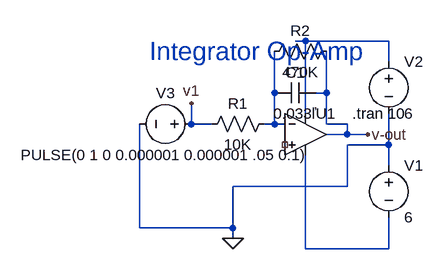
[diagram p0: schematic 5.Integrator Amplifier.asc]
5.Integrator Amplifier.asc, the LTspice schematic file:
Version 4.1
SHEET 1 880 680
WIRE 224 0 208 0
WIRE 352 0 224 0
WIRE 352 32 352 0
WIRE 176 80 176 16
WIRE 256 80 256 16
WIRE 256 80 240 80
WIRE 224 112 224 0
WIRE 48 128 48 96
WIRE 80 128 48 128
WIRE 176 128 176 80
WIRE 176 128 160 128
WIRE 192 128 176 128
WIRE 256 128 256 80
WIRE 288 128 256 128
WIRE 288 144 288 128
WIRE 288 144 256 144
WIRE 320 144 288 144
WIRE 352 160 352 112
WIRE 352 160 288 160
WIRE 352 192 352 160
WIRE 288 224 288 160
WIRE 288 224 112 224
WIRE -32 288 -32 128
WIRE 112 288 112 224
WIRE 112 288 -32 288
WIRE 112 304 112 288
WIRE 224 320 224 176
WIRE 352 320 352 272
WIRE 352 320 224 320
FLAG 112 304 0
FLAG 320 144 v-out
FLAG 48 96 v1
SYMBOL OpAmps\\UniversalOpAmp2 224 144 R0
SYMATTR InstName U1
SYMBOL voltage 352 176 R0
WINDOW 123 0 0 Left 0
WINDOW 39 0 0 Left 0
SYMATTR InstName V1
SYMATTR Value 6
SYMBOL voltage 352 16 R0
WINDOW 123 0 0 Left 0
WINDOW 39 0 0 Left 0
SYMATTR InstName V2
SYMATTR Value 6
SYMBOL voltage 64 128 R90
WINDOW 0 -32 56 VBottom 2
WINDOW 3 32 56 VTop 2
WINDOW 123 0 0 Left 0
WINDOW 39 0 0 Left 0
SYMATTR InstName V3
SYMATTR Value PULSE(0 1 0 0.000001 0.000001 .05 0.1)
SYMBOL res 176 112 R90
WINDOW 0 0 56 VBottom 2
WINDOW 3 32 56 VTop 2
SYMATTR InstName R1
SYMATTR Value 10K
SYMATTR SpiceLine tol=1 pwr=0.1
SYMBOL cap 240 64 R90
WINDOW 0 0 32 VBottom 2
WINDOW 3 32 32 VTop 2
SYMATTR InstName C1
SYMATTR Value 0.033ľ
SYMATTR SpiceLine V=25 Irms=0 Rser=0 Lser=0 mfg="Murata" pn="GCM155R71E333KA55" type="X7R"
SYMBOL res 272 0 R90
WINDOW 0 0 56 VBottom 2
WINDOW 3 32 56 VTop 2
SYMATTR InstName R2
SYMATTR Value 470K
SYMATTR SpiceLine tol=1 pwr=0.1
TEXT -16 16 Left 4 ;Integrator Op-Amp
TEXT 296 112 Left 2 !.tran 10

The netlist it stands for:
* 5.Integrator Amplifier.asc
X§U1 NC_01 N002 N001 N003 v-out level2 Avol=1Meg GBW=10Meg Slew=10Meg Ilimit=25m Rail=0 Vos=0 En=0 Enk=0 In=0 Ink=0 Rin=500Meg  ; pins In+ In- V+ V- OUT
V1 0 N003 6
V2 N001 0 6
V3 v1 0 PULSE(0 1 0 0.000001 0.000001 .05 0.1)
R1 N002 v1 10K tol=1 pwr=0.1
C1 v-out N002 0.033ľ V=25 Irms=0 Rser=0 Lser=0 mfg="Murata" pn="GCM155R71E333KA55" type="X7R"
R2 v-out N002 470K tol=1 pwr=0.1
* Integrator Op-Amp
.tran 10
.lib UniversalOpAmp2.lib
.backanno
.end